# Altium schematic sheet 10_USB_HOST.SchDoc: =TitleParameter
size A3; Address: Crete IL; Organization: ASISGUARD; Address1: Kemalpasa, Kemalpasa Cd. No:290 D:292H, 35060 Bornova/Izmir/Turkey
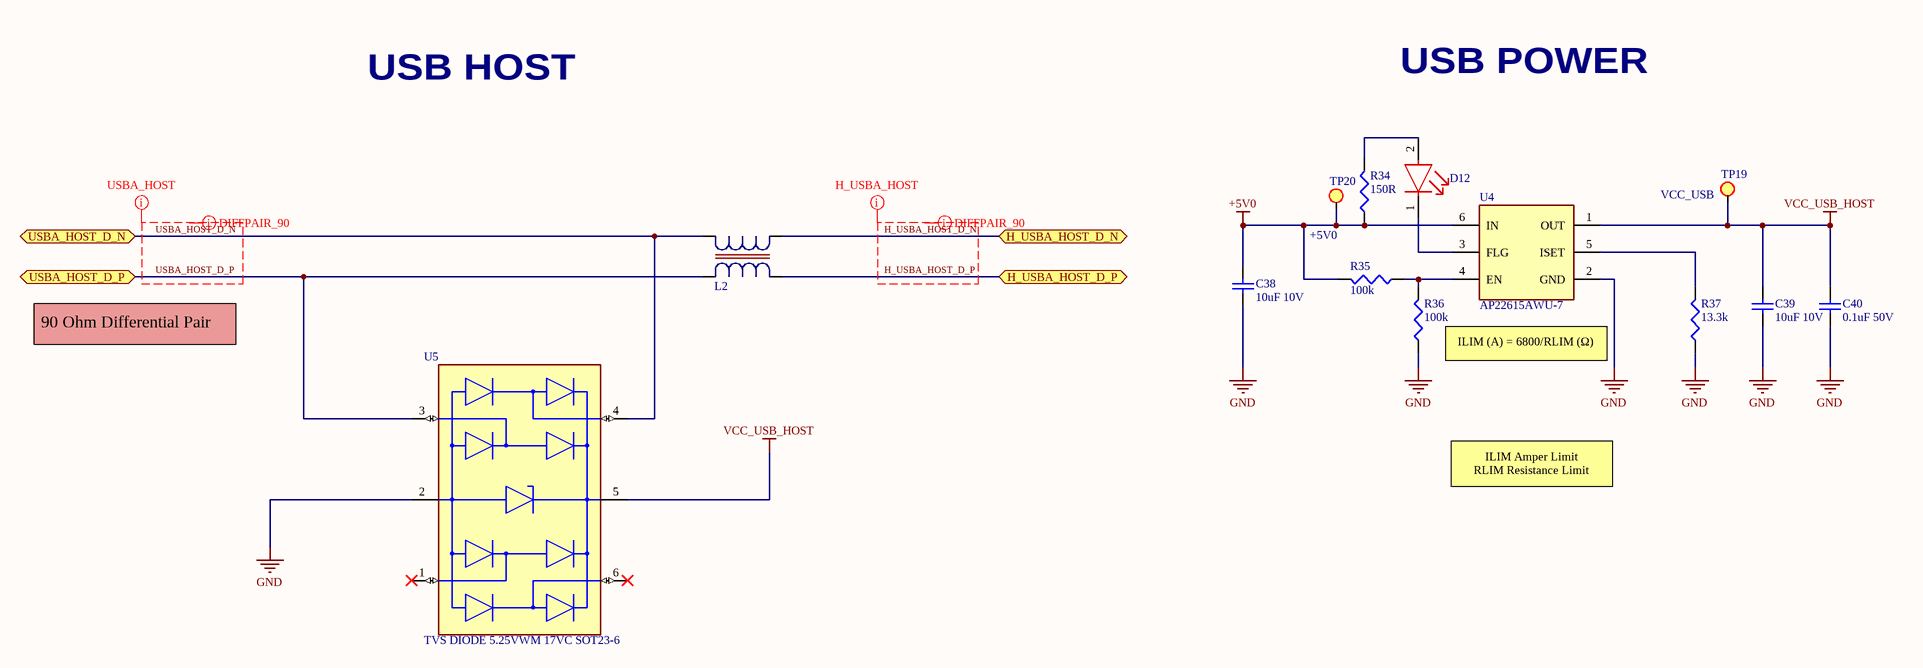
[diagram p0: 10_USB_HOST.SchDoc]

## Parts
C38  value 10uF 10V  [SMC0603]  (hidden comment: CAP CER 10UF 10V X5R 0603)
C39  value 10uF 10V  [SMC0603]  (hidden comment: CAP CER 10UF 10V X5R 0603)
C40  value 0.1uF 50V  [CAP0402(1005)x0.5]  (hidden comment: CAP CER 0.1UF 50V X7R 0402)
D12  LED RED CLEAR SMD  [Lite-On_0_MFG]  (value not drawn)
L2  CMC 100MA 2LN 90 OHM SMD  [IND_MCZ1210AH_TDK]  (value not drawn)
R34  value 150R  [SMR0603]  (hidden comment: RES 150 OHM 1% 1/10W 0603)
R35  value 100k  [RES0402(1005)]  (hidden comment: RES 100K OHM 1% 1/16W 0402)
R36  value 100k  [RES0402(1005)]  (hidden comment: RES 100K OHM 1% 1/16W 0402)
R37  value 13.3k  [RES0402(1005)]  (hidden comment: RES 13.3K OHM 1% 1/16W 0402)
TP19  VCC_USB  [TEST_POINT]
TP20  +5V0  [TEST_POINT]
U4  IC PWR SWTCH N/P-CHAN 1:1 TSOT26  [SOT95P280X100-6N]  (value not drawn)
U5  TVS DIODE 5.25VWM 17VC SOT23-6  [SOT95P280X145-6N]

## Ports
H_USBA_HOST_D_N (bidir), H_USBA_HOST_D_P (bidir), USBA_HOST_D_N (bidir), USBA_HOST_D_P (bidir)

## Nets
+5V0: C38.2 R34.1 R35.2 TP20.1(TP) U4.6(IN)
GND: C38.1 C39.1 C40.1 R36.1 R37.1 U4.2(GND) U5.2(GND)
VCC_USB_HOST: C39.2 C40.2 TP19.1(TP) U4.1(OUT) U5.5(VP)
H_USBA_HOST_D_N: L2.3 ; port H_USBA_HOST_D_N
H_USBA_HOST_D_P: L2.4 ; port H_USBA_HOST_D_P
USBA_HOST_D_N: L2.2 U5.4(I/O3) ; port USBA_HOST_D_N
USBA_HOST_D_P: L2.1 U5.3(I/O2) ; port USBA_HOST_D_P
NetD12_1: D12.1(C) U4.3(FLG)
NetD12_2: D12.2(A) R34.2
NetR35_1: R35.1 R36.2 U4.4(EN)
NetR37_2: R37.2 U4.5(ISET)

Not connected (* = marked no-connect by the designer): U5 1(I/O1)* 6(I/O4)*

## Layout directives
net class USBA_HOST: USBA_HOST_D_N, USBA_HOST_D_P
net class H_USBA_HOST: H_USBA_HOST_D_N, H_USBA_HOST_D_P
differential pair; differential pair class ZDIFF90: H_USBA_HOST_D_N, H_USBA_HOST_D_P, USBA_HOST_D_N, USBA_HOST_D_P

## Notes on the sheet
- USB HOST
- USB POWER
- 90 Ohm Differential Pair
- (near R36) ILIM (A) = 6800/RLIM (Ω)
- ILIM Amper Limit                                                                                     RLIM Resistance Limit
- Proje/Project:
- Sayfa Adı/Document Name:
- Çizilme Tarihi/Drawing Date
- Umit KAYACIK
- Tasarlayan/Designed By
- Sayfa/Sheet:
- Revision:
- of
- Son Güncelleme/Last Edit Date
- Kontrol eden/Checked By
- Onaylayan/Approved By
- Boyut/Size:
- Varyant/Variant:
- Dil/Language:
- A3
- ENG

## Library data of the parts
C38 C39 = CAP0603_10UF_10V: 10 µF ±10% 10V Ceramic Capacitor X5R 0603 (1608 Metric); Manufacturer Part Number: CL10A106KP8NNNC; Order Code: DIGI: 1276-1192-2-ND; Sirius Stock Code: *; LCSC Part Number: C19702; LCSC Manufacturer Part Number: CL10A106KP8NNNC
C40 = CAP0402_0.1UF_50V: 0.1 µF ±10% 50V Ceramic Capacitor X7R 0402 (1005 Metric); Manufacturer Part Number: CL05B104KB54PNC; Order Code: DIGI: 1276-CL05B104KB54PNCTR-ND; Sirius Stock Code: *; LCSC Part Number: C307331; LCSC Manufacturer Part Number: CL05B104KB54PNC
D12 = LTST-C191KRKT: Red 631nm LED Indication - Discrete 2V 0603 (1608 Metric); Order Code: Digi: 160-1447-2-ND; Manufacturer Part Number: LTST-C191KRKT; LCSC Manufacturer Part Number: LTST-C191KRKT; LCSC Part Number: C125099
L2 = MCZ1210AH900L2T: 2 Line Common Mode Choke Surface Mount 90 Ohms @ 100 MHz 100mA DCR 1.75Ohm; Manufacturer Part Number: MCZ1210AH900L2TA0G; LCSC Manufacturer Part Number: MCZ1210AH900L2TD0G; Order Code: Digi: 445-MCZ1210AH900L2TA0GTR-ND; LCSC Part Number: C435268
R34 = RES0603_150R_%1: 150 Ohms ±1% 0.1W, 1/10W Chip Resistor 0603 (1608 Metric) Moisture Resistant Thick Film; Manufacturer Part Number: RC0603FR-07150RL; Order Code: Digi: 311-150HRTR-ND; Sirius Stock Code: *; LCSC Part Number: C114608; LCSC Manufacturer Part Number: RC0603FR-07150RL
R35 R36 = RES0402_100K_%1: 100 kOhms ±1% 0.063W, 1/16W Chip Resistor 0402 (1005 Metric) Moisture Resistant Thick Film; Manufacturer Part Number: RC0402FR-07100KL; Order Code: Digi: 311-100KLRTR-ND; Sirius Stock Code: *; LCSC Part Number: C60491; LCSC Manufacturer Part Number: RC0402FR-07100KL
R37 = RES0402_13K3_%1: Manufacturer Part Number: RC0402FR-0713K3L; Order Code: Digi: YAG2974TR-ND; Sirius Stock Code: *; LCSC Manufacturer Part Number: RC0402FR-0713K3L; LCSC Part Number: C274352
TP19 TP20 = TP_1
U4 = AP22615AWU-7: Power Switch/Driver 1:1 N/P-Channel 3A TSOT-26; Order Code: Digi: AP22615AWU-7DITR-ND; LCSC Manufacturer Part Number: AP22615AWU-7; LCSC Part Number: C2680357; Manufacturer Part Number: AP22615AWU-7
U5 = USBLC6-4SC6: 17V Clamp 5A (8/20µs) Ipp Tvs Diode Surface Mount SOT-23-6; Order Code: Digi: 497-4492-2-ND; Manufacturer Part Number: USBLC6-4SC6; LCSC Manufacturer Part NUmber: USBLC6-4SC6; LCSC Part Number: C111212